# Altium schematic sheet Top_Level_Block_Diagram.SchDoc: BLDC Motor Driver Block Diagram
size A3; DocumentNumber: 1; SheetNumber: 1; SheetTotal: 51
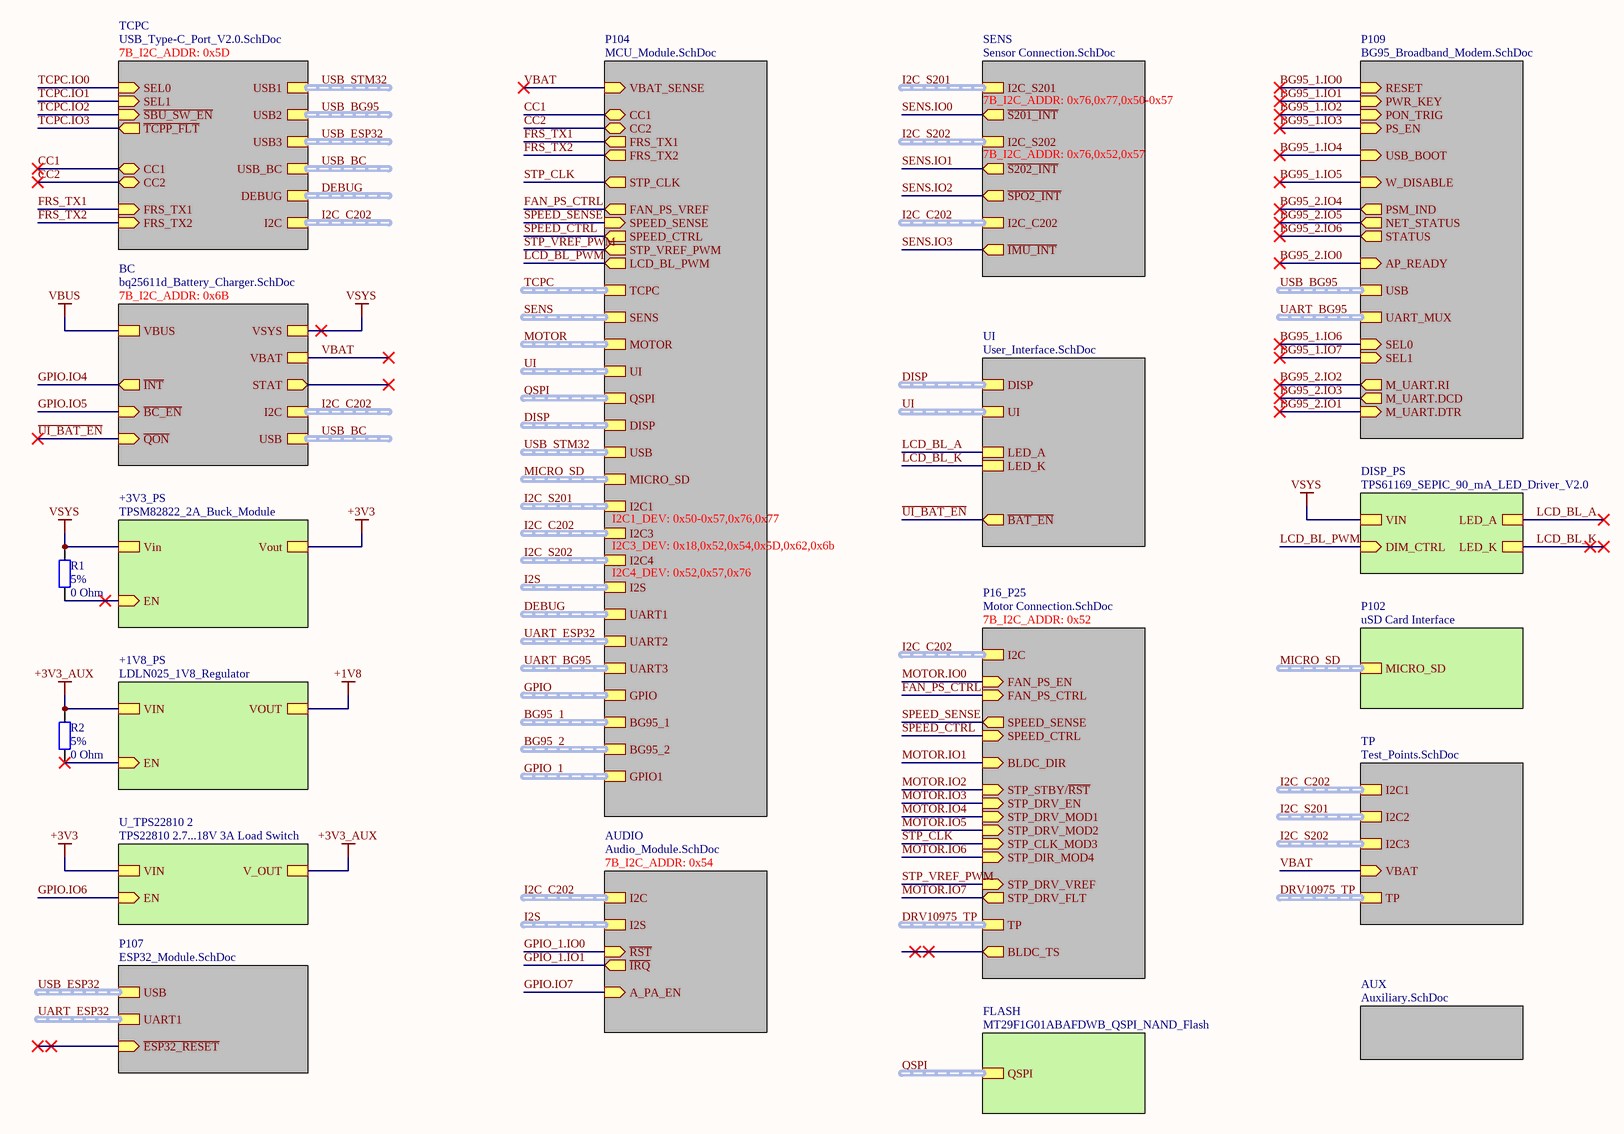
[diagram p0: Top_Level_Block_Diagram.SchDoc]

## Parts
R1  Tolerance: 5%  Resistance: 0 Ohm  [R0402]  (hidden comment: RES SMD 0 OHM JUMPER 1/16W 0402)
R2  Tolerance: 5%  Resistance: 0 Ohm  [R0402]  (hidden comment: RES SMD 0 OHM JUMPER 1/16W 0402)

## Sub-sheets
+1V8_PS = LDLN025_1V8_Regulator: EN (in), VIN, VOUT
+3V3_PS = TPSM82822_2A_Buck_Module: Vout, Vin, EN (in)
AUDIO = Audio_Module.SchDoc: I2S (harness I2S), I2C (harness I2C), ~{RST} (in), ~{IRQ} (out), A_PA_EN (in)  | 7B_I2C_ADDR: 0x54
AUX = Auxiliary.SchDoc: no entries
BC = bq25611d_Battery_Charger.SchDoc: VSYS, VBUS, ~{QON} (in), USB (harness USB), I2C (harness I2C), ~{INT} (out), STAT (out), ~{BC_EN} (in), VBAT  | 7B_I2C_ADDR: 0x6B
DISP_PS = TPS61169_SEPIC_90_mA_LED_Driver_V2.0: VIN, LED_K, DIM_CTRL (in), LED_A
FLASH = MT29F1G01ABAFDWB_QSPI_NAND_Flash: QSPI (harness QSPI)
P16_P25 = Motor Connection.SchDoc: SPEED_CTRL (in), SPEED_SENSE (out), FAN_PS_CTRL (in), BLDC_DIR (in), I2C (harness I2C), STP_STBY/~{RST} (in), STP_DRV_EN (in), STP_DRV_MOD1 (in), STP_DRV_MOD2 (in), STP_CLK_MOD3 (in), STP_DIR_MOD4 (in), STP_DRV_VREF (in), STP_DRV_FLT (out), FAN_PS_EN (in), TP (harness DRV10975_TP), BLDC_TS (out)  | 7B_I2C_ADDR: 0x52
P102 = uSD Card Interface: MICRO_SD (harness MICRO_SD)
P104 = MCU_Module.SchDoc: FAN_PS_VREF (out), SPEED_CTRL (out), SPEED_SENSE (in), CC2 (bidir), CC1 (bidir), I2C1 (harness I2C), VBAT_SENSE (in), MICRO_SD (harness MICRO_SD), DISP (harness DISP_SPI), USB (harness USB), STP_CLK (out), STP_VREF_PWM (out), LCD_BL_PWM (out), QSPI (harness QSPI), FRS_TX1 (out), FRS_TX2 (out), I2C3 (harness I2C), UART1 (harness DEBUG), I2C4 (harness I2C), UART3 (harness UART), I2S (harness I2S), UART2 (harness UART), GPIO (harness GPIO), MOTOR (harness GPIO), BG95_1 (harness GPIO), SENS (harness GPIO), BG95_2 (harness GPIO), UI (harness GPIO), TCPC (harness GPIO), GPIO1 (harness GPIO)  | I2C3_DEV: 0x18,0x52,0x54,0x5D,0x62,0x6b; I2C1_DEV: 0x50-0x57,0x76,0x77; I2C4_DEV: 0x52,0x57,0x76
P107 = ESP32_Module.SchDoc: ~{ESP32_RESET} (in), UART1 (harness UART), USB (harness USB)
P109 = BG95_Broadband_Modem.SchDoc: PWR_KEY (in), PON_TRIG (in), W_DISABLE (in), USB_BOOT (in), NET_STATUS (out), AP_READY (in), STATUS (out), PSM_IND (out), PS_EN (in), RESET (in), USB (harness USB), SEL1 (in), SEL0 (in), UART_MUX (harness UART), M_UART.RI (out), M_UART.DCD (out), M_UART.DTR (in)
SENS = Sensor Connection.SchDoc: ~{S201_INT} (out), I2C_S201 (harness I2C), I2C_S202 (harness I2C), ~{S202_INT} (out), ~{SPO2_INT} (out), I2C_C202 (harness I2C), ~{IMU_INT} (out)  | 7B_I2C_ADDR: 0x76,0x77,0x50-0x57; 7B_I2C_ADDR: 0x76,0x52,0x57
TCPC = USB_Type-C_Port_V2.0.SchDoc: CC1 (bidir), CC2 (bidir), USB1 (harness USB), USB2 (harness USB), SEL1 (in), SEL0 (in), ~{TCPP_FLT} (out), USB3 (harness USB), USB_BC (harness USB), FRS_TX1 (in), FRS_TX2 (in), I2C (harness I2C), ~{SBU_SW_EN} (in), DEBUG (harness DEBUG)  | 7B_I2C_ADDR: 0x5D
TP = Test_Points.SchDoc: I2C1 (harness I2C), I2C2 (harness I2C), I2C3 (harness I2C), VBAT (in), TP (harness DRV10975_TP)
U_TPS22810 2 = TPS22810 2.7...18V 3A Load Switch: EN (in), V_OUT, VIN
UI = User_Interface.SchDoc: ~{BAT_EN} (out), DISP (harness DISP_SPI), LED_A, LED_K, UI (harness GPIO)

## Nets
+1V8: sheet +1V8_PS/VOUT
+3V3: sheet +3V3_PS/Vout, sheet U_TPS22810 2/VIN
+3V3_AUX: R2.2 ; sheet +1V8_PS/VIN, sheet U_TPS22810 2/V_OUT
VBUS: sheet BC/VBUS
VSYS: R1.2 ; sheet BC/VSYS, sheet +3V3_PS/Vin, sheet DISP_PS/VIN
~{UI_BAT_EN}: sheet BC/~{QON}, sheet UI/~{BAT_EN}
BG95_1.IO0: sheet P109/RESET
BG95_1.IO1: sheet P109/PWR_KEY
BG95_1.IO2: sheet P109/PON_TRIG
BG95_1.IO3: sheet P109/PS_EN
BG95_1.IO4: sheet P109/USB_BOOT
BG95_1.IO5: sheet P109/W_DISABLE
BG95_1.IO6: sheet P109/SEL0
BG95_1.IO7: sheet P109/SEL1
BG95_2.IO0: sheet P109/AP_READY
BG95_2.IO1: sheet P109/M_UART.DTR
BG95_2.IO2: sheet P109/M_UART.RI
BG95_2.IO3: sheet P109/M_UART.DCD
BG95_2.IO4: sheet P109/PSM_IND
BG95_2.IO5: sheet P109/NET_STATUS
BG95_2.IO6: sheet P109/STATUS
CC1: sheet TCPC/CC1, sheet P104/CC1
CC2: sheet TCPC/CC2, sheet P104/CC2
FAN_PS_CTRL: sheet P104/FAN_PS_VREF, sheet P16_P25/FAN_PS_CTRL
FRS_TX1: sheet TCPC/FRS_TX1, sheet P104/FRS_TX1
FRS_TX2: sheet TCPC/FRS_TX2, sheet P104/FRS_TX2
GPIO.IO4: sheet BC/~{INT}
GPIO.IO5: sheet BC/~{BC_EN}
GPIO.IO6: sheet U_TPS22810 2/EN
GPIO.IO7: sheet AUDIO/A_PA_EN
GPIO_1.IO0: sheet AUDIO/~{RST}
GPIO_1.IO1: sheet AUDIO/~{IRQ}
LCD_BL_A: sheet UI/LED_A, sheet DISP_PS/LED_A
LCD_BL_K: sheet UI/LED_K, sheet DISP_PS/LED_K
LCD_BL_PWM: sheet P104/LCD_BL_PWM, sheet DISP_PS/DIM_CTRL
MOTOR.IO0: sheet P16_P25/FAN_PS_EN
MOTOR.IO1: sheet P16_P25/BLDC_DIR
MOTOR.IO2: sheet P16_P25/STP_STBY/~{RST}
MOTOR.IO3: sheet P16_P25/STP_DRV_EN
MOTOR.IO4: sheet P16_P25/STP_DRV_MOD1
MOTOR.IO5: sheet P16_P25/STP_DRV_MOD2
MOTOR.IO6: sheet P16_P25/STP_DIR_MOD4
MOTOR.IO7: sheet P16_P25/STP_DRV_FLT
SENS.IO0: sheet SENS/~{S201_INT}
SENS.IO1: sheet SENS/~{S202_INT}
SENS.IO2: sheet SENS/~{SPO2_INT}
SENS.IO3: sheet SENS/~{IMU_INT}
SPEED_CTRL: sheet P104/SPEED_CTRL, sheet P16_P25/SPEED_CTRL
SPEED_SENSE: sheet P104/SPEED_SENSE, sheet P16_P25/SPEED_SENSE
STP_CLK: sheet P104/STP_CLK, sheet P16_P25/STP_CLK_MOD3
STP_VREF_PWM: sheet P104/STP_VREF_PWM, sheet P16_P25/STP_DRV_VREF
TCPC.IO0: sheet TCPC/SEL0
TCPC.IO1: sheet TCPC/SEL1
TCPC.IO2: sheet TCPC/~{SBU_SW_EN}
TCPC.IO3: sheet TCPC/~{TCPP_FLT}
VBAT: sheet TP/VBAT, sheet P104/VBAT_SENSE, sheet BC/VBAT
NetR1_1: R1.1 ; sheet +3V3_PS/EN
NetR2_1: R2.1 ; sheet +1V8_PS/EN

## Buses and harness runs
harness BG95_1 = sheet P104/BG95_1
harness BG95_2 = sheet P104/BG95_2
harness DEBUG = sheet P104/UART1
harness DEBUG = sheet TCPC/DEBUG
harness DISP = sheet P104/DISP
harness DISP = sheet UI/DISP
harness DRV10975_TP = sheet P16_P25/TP
harness DRV10975_TP = sheet TP/TP
harness GPIO = sheet P104/GPIO
harness GPIO_1 = sheet P104/GPIO1
harness I2C_C202 = sheet AUDIO/I2C
harness I2C_C202 = sheet BC/I2C
harness I2C_C202 = sheet P16_P25/I2C
harness I2C_C202 = sheet P104/I2C3
harness I2C_C202 = sheet SENS/I2C_C202
harness I2C_C202 = sheet TCPC/I2C
harness I2C_C202 = sheet TP/I2C1
harness I2C_S201 = sheet P104/I2C1
harness I2C_S201 = sheet SENS/I2C_S201
harness I2C_S201 = sheet TP/I2C2
harness I2C_S202 = sheet P104/I2C4
harness I2C_S202 = sheet SENS/I2C_S202
harness I2C_S202 = sheet TP/I2C3
harness I2S = sheet AUDIO/I2S
harness I2S = sheet P104/I2S
harness MICRO_SD = sheet P102/MICRO_SD
harness MICRO_SD = sheet P104/MICRO_SD
harness MOTOR = sheet P104/MOTOR
harness QSPI = sheet FLASH/QSPI
harness QSPI = sheet P104/QSPI
harness SENS = sheet P104/SENS
harness TCPC = sheet P104/TCPC
harness UART_BG95 = sheet P104/UART3
harness UART_BG95 = sheet P109/UART_MUX
harness UART_ESP32 = sheet P104/UART2
harness UART_ESP32 = sheet P107/UART1
harness UI = sheet P104/UI
harness UI = sheet UI/UI
harness USB_BC = sheet BC/USB
harness USB_BC = sheet TCPC/USB_BC
harness USB_BG95 = sheet P109/USB
harness USB_BG95 = sheet TCPC/USB2
harness USB_ESP32 = sheet P107/USB
harness USB_ESP32 = sheet TCPC/USB3
harness USB_STM32 = sheet P104/USB
harness USB_STM32 = sheet TCPC/USB1

## Notes on the sheet
- Title
- Size:
- Date:
- A3
- Number:
- Time:
- Revision:
- Sheet
- of
- File:

## Library data of the parts
R1 R2 = RES SMD 0 OHM JUMPER 1/16W 0402: 0 Ohms Jumper 0.063W, 1/16W Chip Resistor 0402 (1005 Metric) Moisture Resistant Thick Film; Manufacturer: Yageo; Manufacturer Part Number: RC0402JR-070RL; Power Rating: 62.5mW; Voltage Rating: 50V; Max Power Dissipation: 63mW; Temperature Coefficient: 200ppm/°C; Supplier 1: Digi-Key; Stock 1: 46057148; Pricing 1: 1=0.1, 10=0.013, 25=0.0092, 50=0.0072, 100=0.0053, 250=0.004, 500=0.0032, 1000=0.0024, 5000=0.0017 (USD); Contact Plating: Tin,Matte; Case Code (Metric): 1005; Case Code (Imperial): 0402; Min Operating Temperature: -55°C; Max Operating Temperature: 155°C; Packaging: Tape and Reel; Composition: Thick Film; Package Quantity: 1; Number of Terminations: 2; Termination: SMD/SMT; Military Standard: Not; Features: Moisture Resistant; Length: 1mm; Height: 0.016inch; Width: 0.02inch; Depth: 0.5mm; Radiation Hardening: No; REACH SVHC: Unknown; Lead Free: Lead Free; ComponentLink1URL: http://www.yageo.com/documents/recent/PYu-RC_Group_51_RoHS_L_10.pdf?src-supplier=Digi-Key; ComponentLink1Description: http://www.yageo.com/documents/recent/PYu-RC_Group_51_RoHS_L_10.pdf?src-supplier=Digi-Key; ComponentLink2URL: http://www.yageo.com/documents/recent/PYu-RC0402_51_RoHS_L_6.pdf?src-supplier=Avnet+Europe; ComponentLink2Description: http://www.yageo.com/documents/recent/PYu-RC0402_51_RoHS_L_6.pdf?src-supplier=Avnet+Europe; ComponentLink3URL: http://www.farnell.com/datasheets/1018594.pdf?src-supplier=Element14; ComponentLink3Description: http://www.farnell.com/datasheets/1018594.pdf?src-supplier=Element14; ComponentLink4URL: https://www.verical.com/server-webapp/html/getDatasheet?partID=326379&src-supplier=Verical; ComponentLink4Description: https://www.verical.com/server-webapp/html/getDatasheet?partID=326379&src-supplier=Verical; ComponentLink5URL: http://www.farnell.com/datasheets/2167052.pdf?src-supplier=Element14; ComponentLink5Description: http://www.farnell.com/datasheets/2167052.pdf?src-supplier=Element14; Supplier Part Number 1: 311-0.0JRCT-ND; Case/Package: 0402; Mount: Surface Mount
  R1: ClassName: +3V3_PS
  R2: ClassName: +1V8_PS